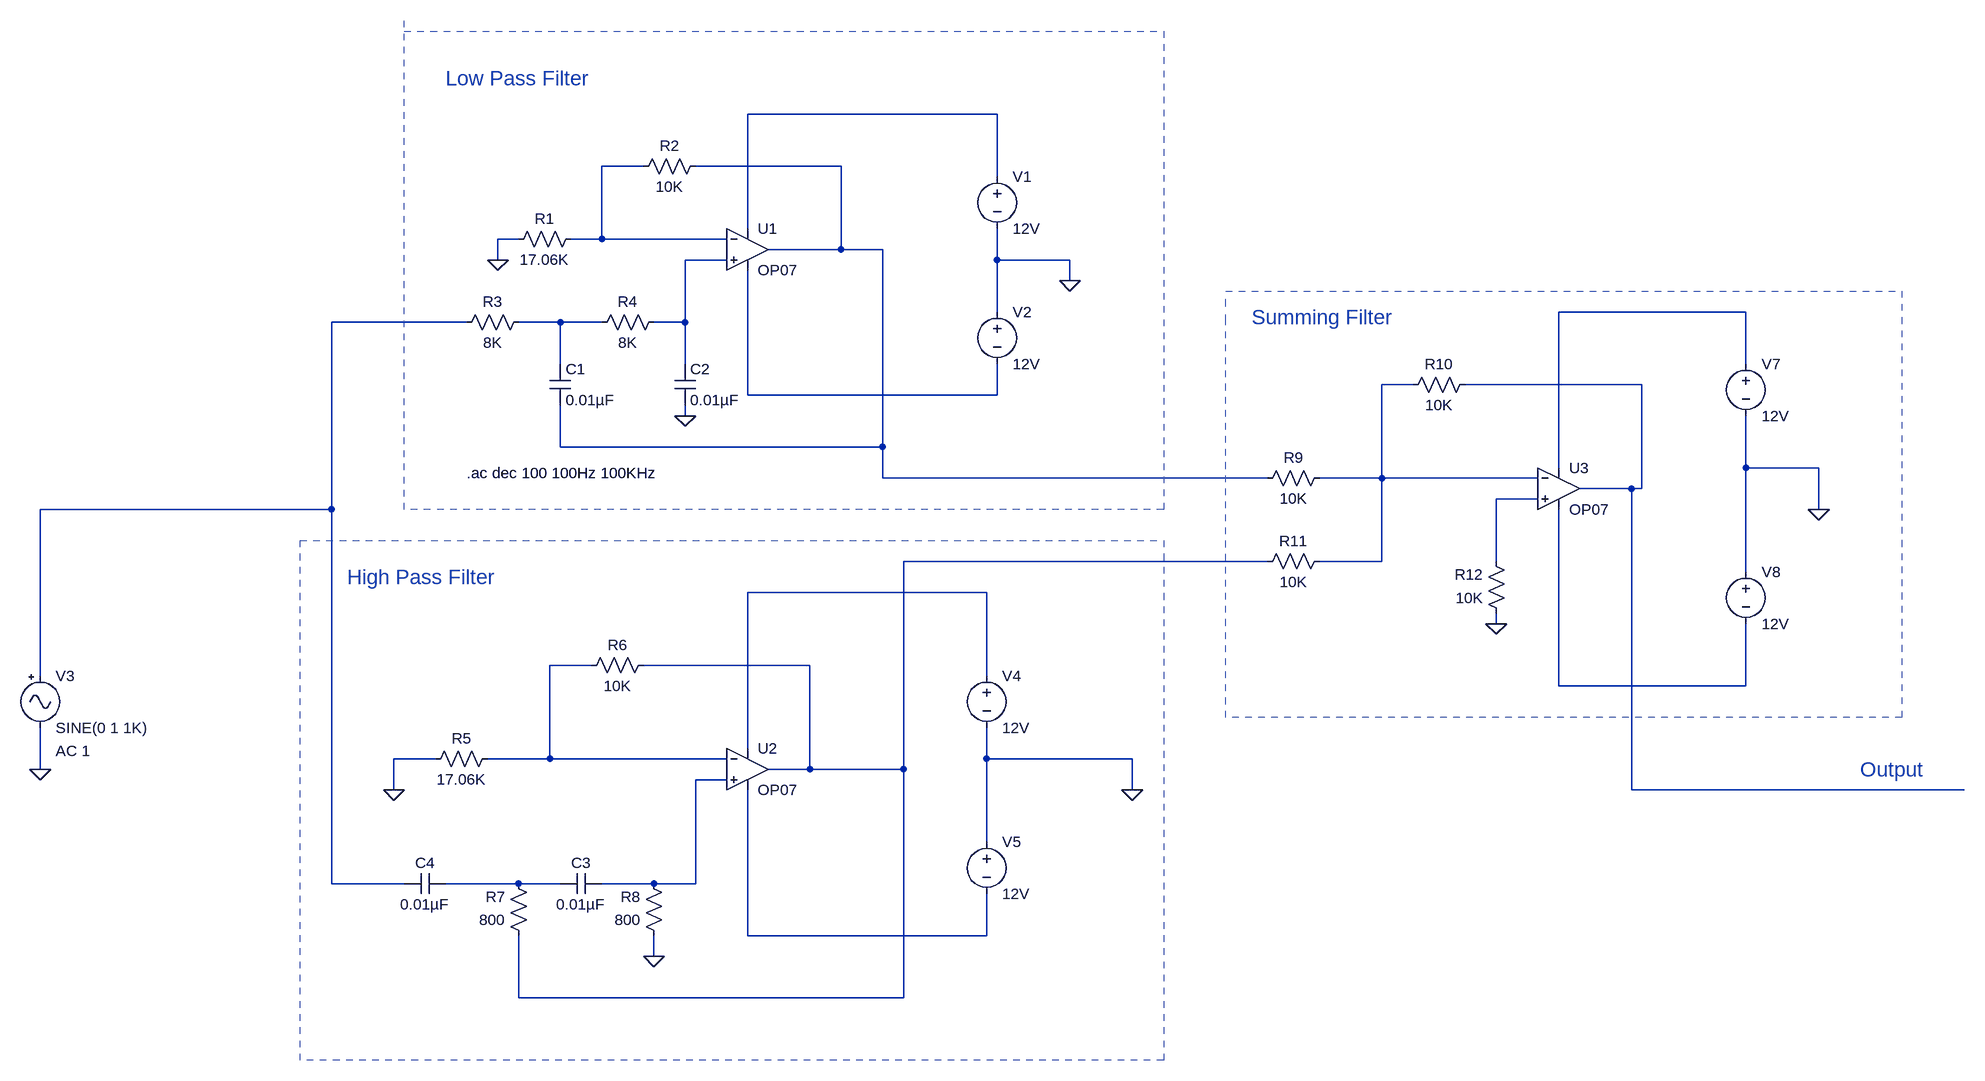
[diagram p0: schematic Band_Reject_Filter.asc]
Band_Reject_Filter.asc, the LTspice schematic file:
Version 4
SHEET 1 2100 1444
WIRE 608 -16 224 -16
WIRE 64 64 0 64
WIRE 368 64 144 64
WIRE 608 80 608 -16
WIRE 224 160 224 -16
WIRE -128 176 -160 176
WIRE 0 176 0 64
WIRE 0 176 -48 176
WIRE 192 176 0 176
WIRE 368 192 368 64
WIRE 368 192 256 192
WIRE 432 192 368 192
WIRE -160 208 -160 176
WIRE 192 208 128 208
WIRE 608 208 608 160
WIRE 720 208 608 208
WIRE 720 240 720 208
WIRE 608 288 608 208
WIRE 1760 288 1472 288
WIRE -208 304 -416 304
WIRE -64 304 -128 304
WIRE 0 304 -64 304
WIRE 128 304 128 208
WIRE 128 304 80 304
WIRE -64 368 -64 304
WIRE 128 368 128 304
WIRE 1760 368 1760 288
WIRE 1248 400 1200 400
WIRE 1600 400 1328 400
WIRE 224 416 224 224
WIRE 608 416 608 368
WIRE 608 416 224 416
WIRE 128 448 128 432
WIRE -64 496 -64 432
WIRE 432 496 432 192
WIRE 432 496 -64 496
WIRE 1472 528 1472 288
WIRE 1760 528 1760 448
WIRE 1872 528 1760 528
WIRE 432 544 432 496
WIRE 1024 544 432 544
WIRE 1200 544 1200 400
WIRE 1200 544 1104 544
WIRE 1440 544 1200 544
WIRE 1584 560 1504 560
WIRE 1600 560 1600 400
WIRE 1600 560 1584 560
WIRE 1440 576 1376 576
WIRE -416 592 -416 304
WIRE -416 592 -864 592
WIRE 1872 592 1872 528
WIRE 1024 672 464 672
WIRE 1200 672 1200 544
WIRE 1200 672 1104 672
WIRE 1376 672 1376 576
WIRE 1760 688 1760 528
WIRE 592 720 224 720
WIRE 1376 768 1376 752
WIRE -16 832 -80 832
WIRE 320 832 64 832
WIRE -864 848 -864 592
WIRE 592 848 592 720
WIRE 1472 864 1472 592
WIRE 1760 864 1760 768
WIRE 1760 864 1472 864
WIRE 224 960 224 720
WIRE -256 976 -320 976
WIRE -80 976 -80 832
WIRE -80 976 -176 976
WIRE 192 976 -80 976
WIRE 592 976 592 928
WIRE 816 976 592 976
WIRE -864 992 -864 928
WIRE 320 992 320 832
WIRE 320 992 256 992
WIRE 464 992 464 672
WIRE 464 992 320 992
WIRE 192 1008 144 1008
WIRE -320 1024 -320 976
WIRE 816 1024 816 976
WIRE 1584 1024 1584 560
WIRE 2096 1024 1584 1024
WIRE 592 1104 592 976
WIRE -416 1168 -416 592
WIRE -304 1168 -416 1168
WIRE -128 1168 -240 1168
WIRE -64 1168 -128 1168
WIRE 80 1168 0 1168
WIRE 144 1168 144 1008
WIRE 144 1168 80 1168
WIRE 224 1248 224 1024
WIRE 592 1248 592 1184
WIRE 592 1248 224 1248
WIRE 80 1280 80 1248
WIRE -128 1344 -128 1248
WIRE 464 1344 464 992
WIRE 464 1344 -128 1344
FLAG 720 240 0
FLAG 128 448 0
FLAG -160 208 0
FLAG 80 1280 0
FLAG -320 1024 0
FLAG 816 1024 0
FLAG 1376 768 0
FLAG -864 992 0
FLAG 1872 592 0
SYMBOL OpAmps\\OP07 224 128 R0
SYMATTR InstName U1
SYMBOL res -32 160 R90
WINDOW 0 0 56 VBottom 2
WINDOW 3 32 56 VTop 2
SYMATTR InstName R1
SYMATTR Value 17.06K
SYMBOL res 160 48 R90
WINDOW 0 0 56 VBottom 2
WINDOW 3 32 56 VTop 2
SYMATTR InstName R2
SYMATTR Value 10K
SYMBOL res -112 288 R90
WINDOW 0 0 56 VBottom 2
WINDOW 3 32 56 VTop 2
SYMATTR InstName R3
SYMATTR Value 8K
SYMBOL res 96 288 R90
WINDOW 0 0 56 VBottom 2
WINDOW 3 32 56 VTop 2
SYMATTR InstName R4
SYMATTR Value 8K
SYMBOL cap -80 368 R0
SYMATTR InstName C1
SYMATTR Value 0.01µF
SYMBOL cap 112 368 R0
SYMATTR InstName C2
SYMATTR Value 0.01µF
SYMBOL voltage 608 64 R0
SYMATTR InstName V1
SYMATTR Value 12V
SYMBOL voltage 608 272 R0
SYMATTR InstName V2
SYMATTR Value 12V
SYMBOL OpAmps\\OP07 224 928 R0
SYMATTR InstName U2
SYMBOL res -160 960 R90
WINDOW 0 0 56 VBottom 2
WINDOW 3 32 56 VTop 2
SYMATTR InstName R5
SYMATTR Value 17.06K
SYMBOL res 80 816 R90
WINDOW 0 0 56 VBottom 2
WINDOW 3 32 56 VTop 2
SYMATTR InstName R6
SYMATTR Value 10K
SYMBOL res -112 1264 R180
WINDOW 0 36 76 Left 2
WINDOW 3 36 40 Left 2
SYMATTR InstName R7
SYMATTR Value 800
SYMBOL res 96 1264 R180
WINDOW 0 36 76 Left 2
WINDOW 3 36 40 Left 2
SYMATTR InstName R8
SYMATTR Value 800
SYMBOL cap 0 1152 R90
WINDOW 0 0 32 VBottom 2
WINDOW 3 32 32 VTop 2
SYMATTR InstName C3
SYMATTR Value 0.01µF
SYMBOL cap -240 1152 R90
WINDOW 0 0 32 VBottom 2
WINDOW 3 32 32 VTop 2
SYMATTR InstName C4
SYMATTR Value 0.01µF
SYMBOL voltage 592 832 R0
SYMATTR InstName V4
SYMATTR Value 12V
SYMBOL voltage 592 1088 R0
SYMATTR InstName V5
SYMATTR Value 12V
SYMBOL OpAmps\\OP07 1472 496 R0
SYMATTR InstName U3
SYMBOL res 1392 768 R180
WINDOW 0 36 76 Left 2
WINDOW 3 36 40 Left 2
SYMATTR InstName R12
SYMATTR Value 10K
SYMBOL voltage 1760 352 R0
SYMATTR InstName V7
SYMATTR Value 12V
SYMBOL voltage 1760 672 R0
SYMATTR InstName V8
SYMATTR Value 12V
SYMBOL Misc\\signal -864 832 R0
WINDOW 123 24 132 Left 2
WINDOW 39 0 0 Left 0
SYMATTR InstName V3
SYMATTR Value2 AC 1
SYMBOL res 1120 528 R90
WINDOW 0 0 56 VBottom 2
WINDOW 3 32 56 VTop 2
SYMATTR InstName R9
SYMATTR Value 10K
SYMBOL res 1344 384 R90
WINDOW 0 0 56 VBottom 2
WINDOW 3 32 56 VTop 2
SYMATTR InstName R10
SYMATTR Value 10K
SYMBOL res 1120 656 R90
WINDOW 0 0 56 VBottom 2
WINDOW 3 32 56 VTop 2
SYMATTR InstName R11
SYMATTR Value 10K
TEXT -208 536 Left 2 !.ac dec 100 100Hz 100KHz
TEXT -240 -72 Left 3 ;Low Pass Filter
TEXT -392 696 Left 3 ;High Pass Filter
TEXT 1000 296 Left 3 ;Summing Filter
TEXT 1936 992 Left 3 ;Output
LINE Normal -304 592 -304 -160 1
LINE Normal 864 592 -304 592 1
LINE Normal 864 -144 864 592 1
LINE Normal -304 -144 864 -144 1
LINE Normal 960 912 960 288 1
LINE Normal 2000 912 960 912 1
LINE Normal 2000 256 2000 912 1
LINE Normal 960 256 2000 256 1
LINE Normal 960 304 960 256 1
LINE Normal -464 640 864 640 1
LINE Normal -464 1440 -464 640 1
LINE Normal 864 1440 -464 1440 1
LINE Normal 864 640 864 1440 1

The netlist it stands for:
* Band_Reject_Filter.asc
XU1 N004 N002 N001 N010 N003 LT1001  ; OP07, pins In+ In- V+ V- OUT
R1 N002 0 17.06K
R2 N003 N002 10K
R3 N007 N006 8K
R4 N004 N007 8K
C1 N007 N003 0.01µF
C2 N004 0 0.01µF
V1 N001 0 12V
V2 0 N010 12V
XU2 N016 N014 N013 N018 N012 LT1001  ; OP07, pins In+ In- V+ V- OUT
R5 N014 0 17.06K
R6 N012 N014 10K
R7 N012 N017 800
R8 0 N016 800
C3 N016 N017 0.01µF
C4 N017 N006 0.01µF
V4 N013 0 12V
V5 0 N018 12V
XU3 N011 N008 N005 N015 N009 LT1001  ; OP07, pins In+ In- V+ V- OUT
R12 0 N011 10K
V7 N005 0 12V
V8 0 N015 12V
V3 N006 0 SINE(0 1 1K) AC 1
R9 N008 N003 10K
R10 N009 N008 10K
R11 N008 N012 10K
.ac dec 100 100Hz 100KHz
* Low Pass Filter
* High Pass Filter
* Summing Filter
* Output
.lib LTC.lib
.backanno
.end